# Altium schematic sheet rxall_blank.SchDoc
size A4
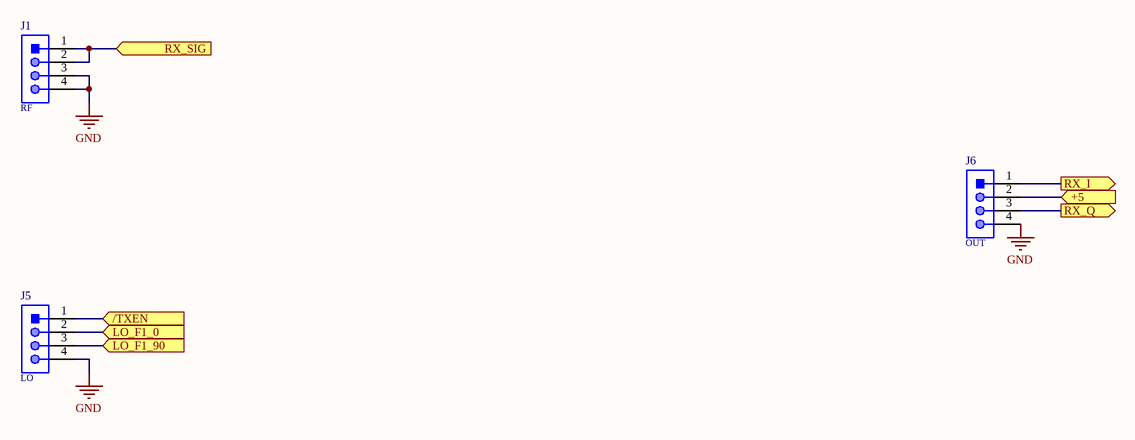
[diagram p0: rxall_blank.SchDoc]

## Parts
J1  RF  [61300411121]
J5  LO  [61300411121]
J6  OUT  [61300411121]

## Ports
+5 (in), /TXEN (in), LO_F1_0 (in), LO_F1_90 (in), RX_I (out), RX_Q (out), RX_SIG (in)

## Nets
GND: J1.3 J1.4 J5.4 J6.4
+5: J6.2 ; port +5
/TXEN: J5.1 ; port /TXEN
LO_F1_0: J5.2 ; port LO_F1_0
LO_F1_90: J5.3 ; port LO_F1_90
RX_I: J6.1 ; port RX_I
RX_Q: J6.3 ; port RX_Q
RX_SIG: J1.1 J1.2 ; port RX_SIG

## Library data of the parts
J1 J5 J6 = CMP-1502-01064-1: THT Vertical Pin Header WR-PHD, Pitch 2.54 mm, Single Row, 4 pins; Manufacturer: Wurth Elektronik; Withstanding Voltage: 500VAC; Rated Current: 3A; Working Voltage: 250VAC; Pin Number: 4; Gender: Male; Contact Resistance: 20mOhm; Pitch: 2.54mm; Manufacturer URL: http://www.we-online.de; Operating Temperature: -40to105degC; Packaging: Bag; Mounting Technology: THT; Package Reference: 61300411121; Datasheet URL: https://katalog.we-online.de/em/datasheet/6130xx11121.pdf; Publisher: WurthElektronik; Part Number: 61300411121; Row Number: Single; Orientation: Vertical